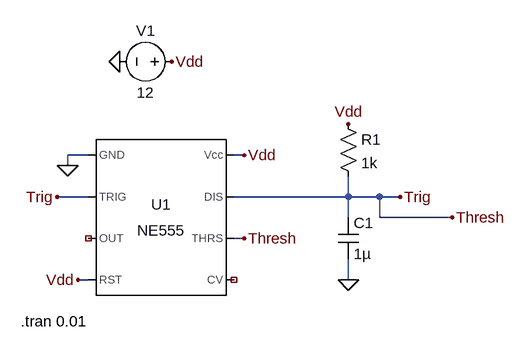
[diagram p0: schematic EE409_Q3_555Triangle.asc]
EE409_Q3_555Triangle.asc, the LTspice schematic file:
Version 4.1
SHEET 1 2336 680
WIRE 80 32 48 32
WIRE 320 32 304 32
WIRE 48 48 48 32
WIRE 80 96 32 96
WIRE 480 96 480 64
WIRE 480 96 304 96
WIRE 528 96 480 96
WIRE 560 96 528 96
WIRE 480 128 480 96
WIRE 528 128 528 96
WIRE 640 128 528 128
WIRE 320 160 304 160
WIRE 80 224 64 224
WIRE 480 224 480 192
FLAG 128 -112 0
FLAG 208 -112 Vdd
FLAG 320 32 Vdd
FLAG 64 224 Vdd
FLAG 48 48 0
FLAG 480 224 0
FLAG 480 -16 Vdd
FLAG 320 160 Thresh
FLAG 32 96 Trig
FLAG 560 96 Trig
FLAG 640 128 Thresh
SYMBOL Misc\\NE555 192 128 R0
SYMATTR InstName U1
SYMBOL voltage 224 -112 R90
WINDOW 0 -32 56 VBottom 2
WINDOW 3 32 56 VTop 2
WINDOW 123 0 0 Left 0
WINDOW 39 0 0 Left 0
SYMATTR InstName V1
SYMATTR Value 12
SYMBOL cap 464 128 R0
SYMATTR InstName C1
SYMATTR Value 1µ
SYMBOL res 464 -32 R0
SYMATTR InstName R1
SYMATTR Value 1k
TEXT -24 288 Left 2 !.tran 0.01

The netlist it stands for:
* EE409_Q3_555Triangle.asc
X§U1 0 Trig NC_01 Vdd NC_02 Trig Trig Vdd NE555  ; pins GND TRIG OUT RST CV THRS DIS Vcc
V1 Vdd 0 12
C1 Trig 0 1µ
R1 Vdd Trig 1k
.tran 0.01
.lib NE555.sub
.backanno
.end